# EasyEDA Pro project Project.epro

# Schematic stm32f1

## Sheets
1 stm32f1
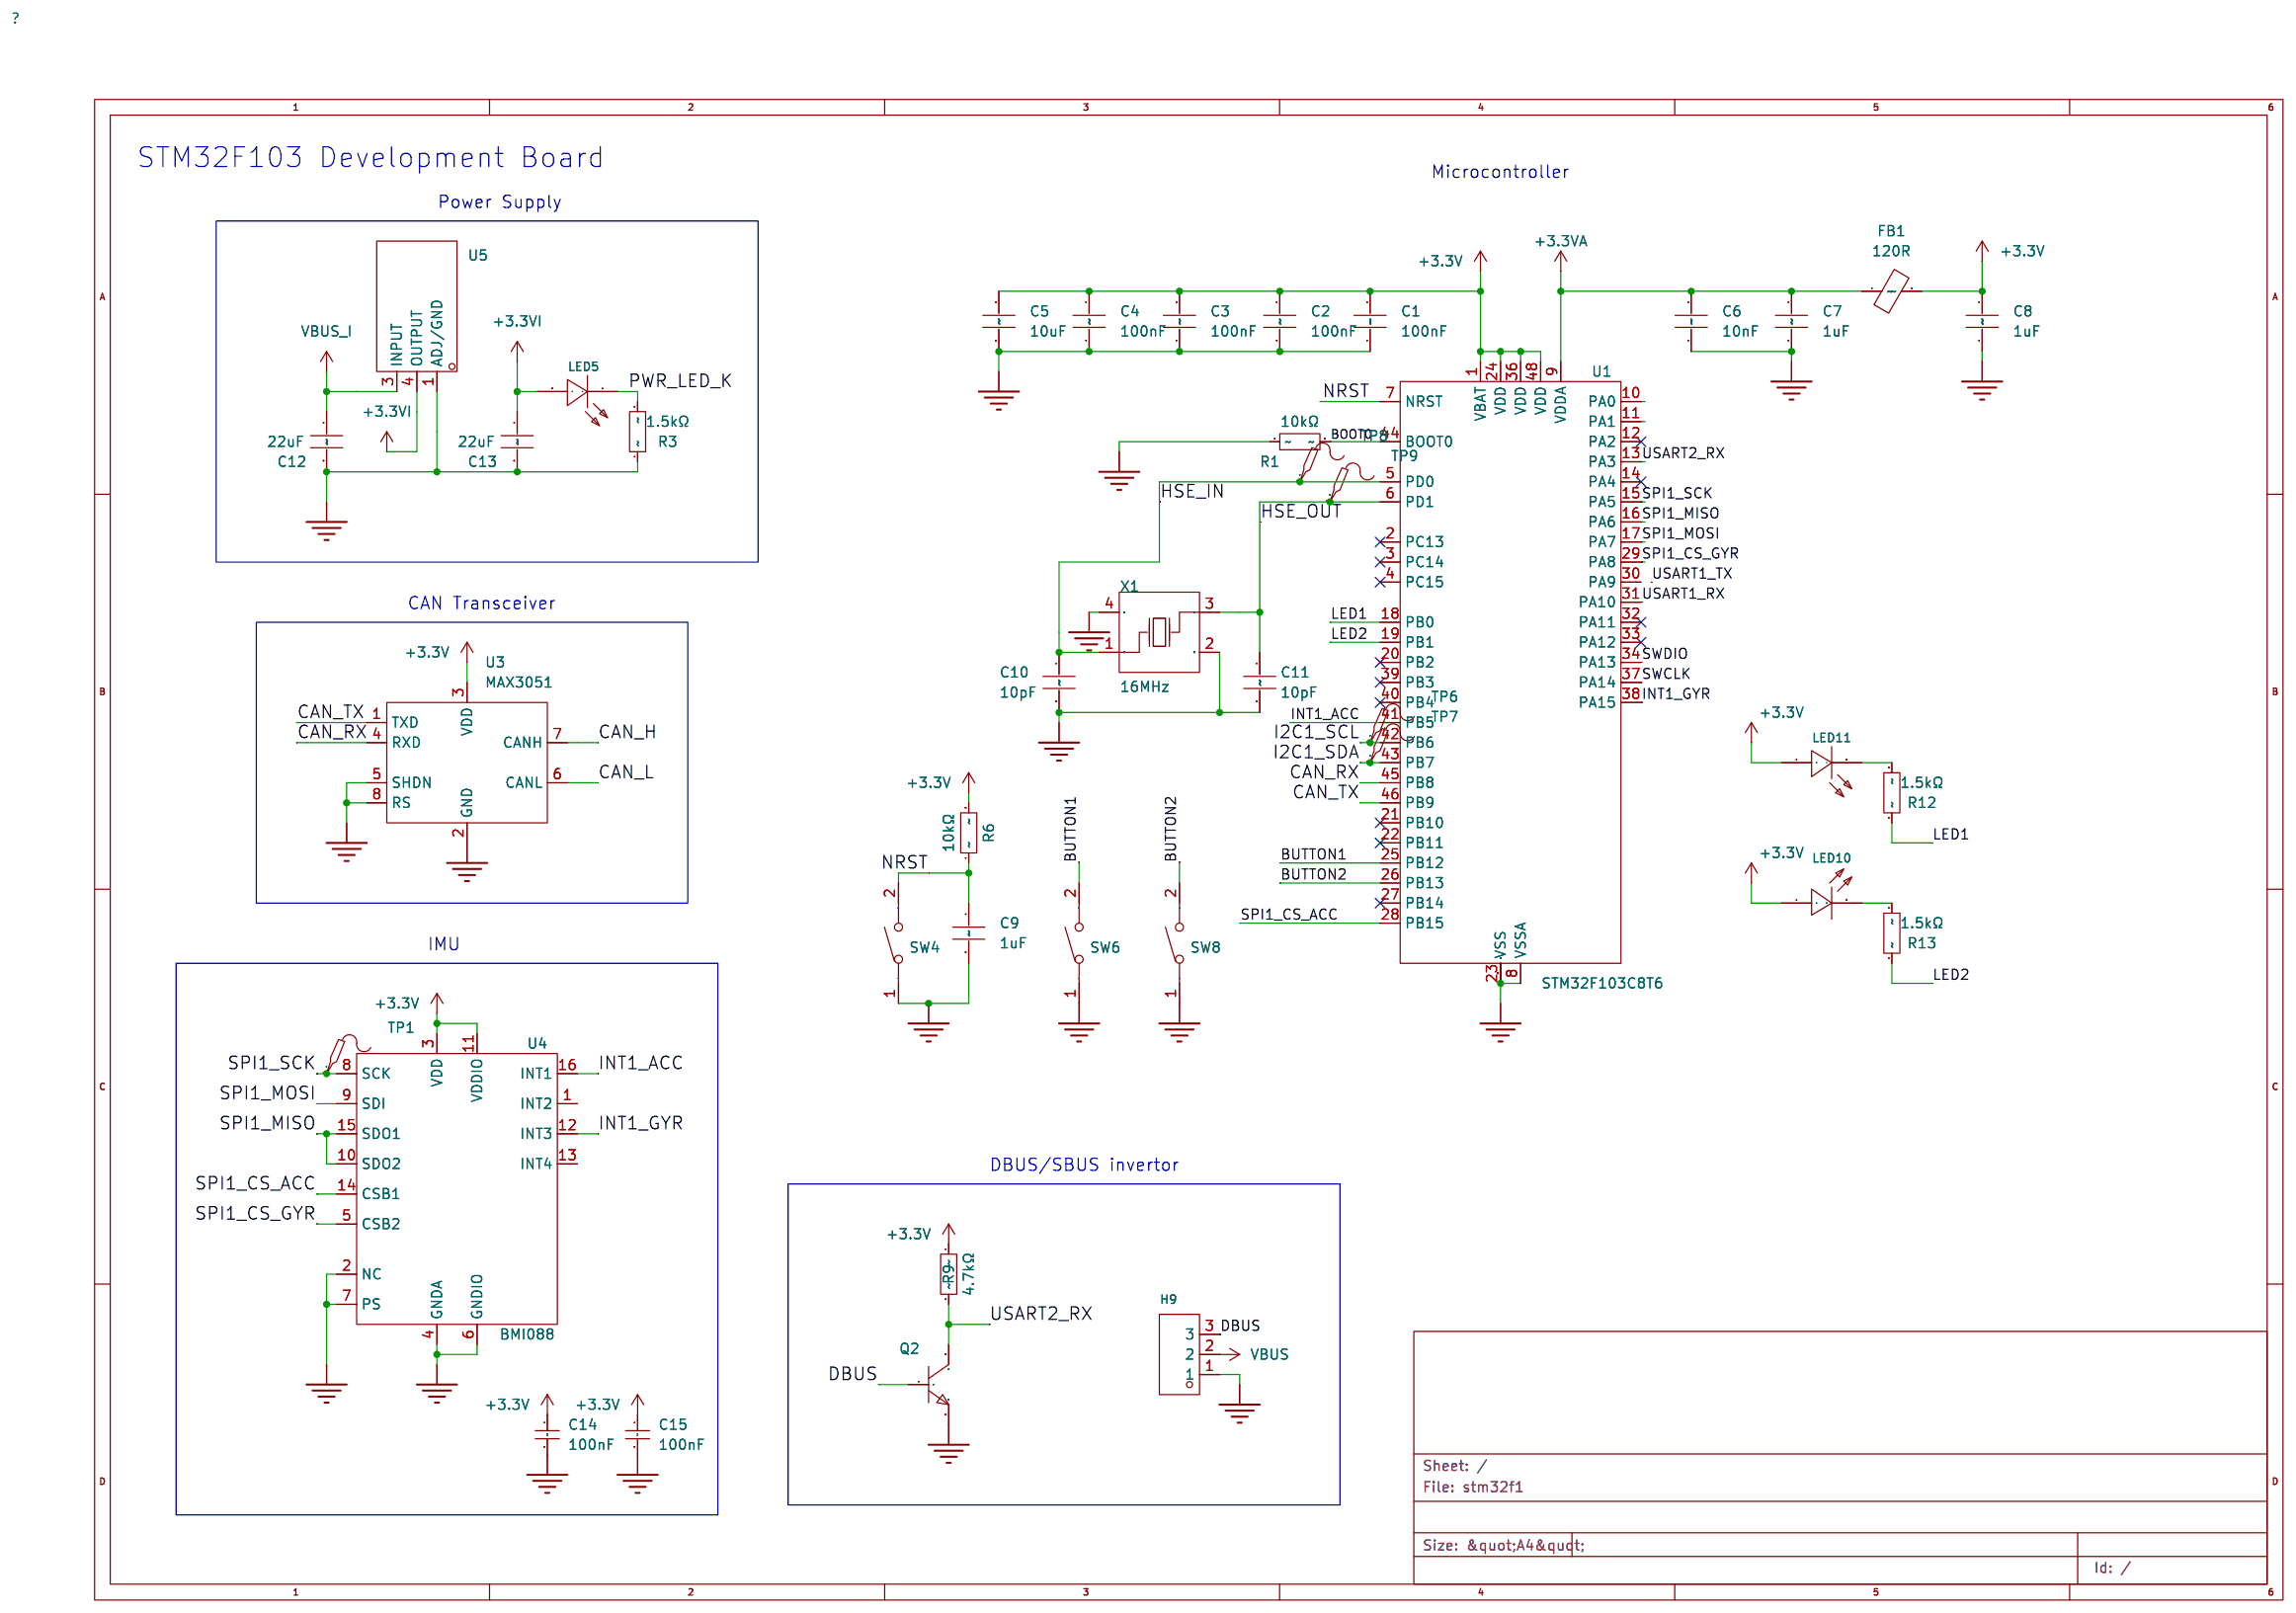
[diagram p0: stm32f1]
2 connectors: Create Date: 2023-10-02; Page Name: connectors; Project Name: stm32f1; Schematic Name: stm32f1; Update Date: 2023-10-05; Company: 嘉立创EDA; Page Size: A4; Version: V1.0
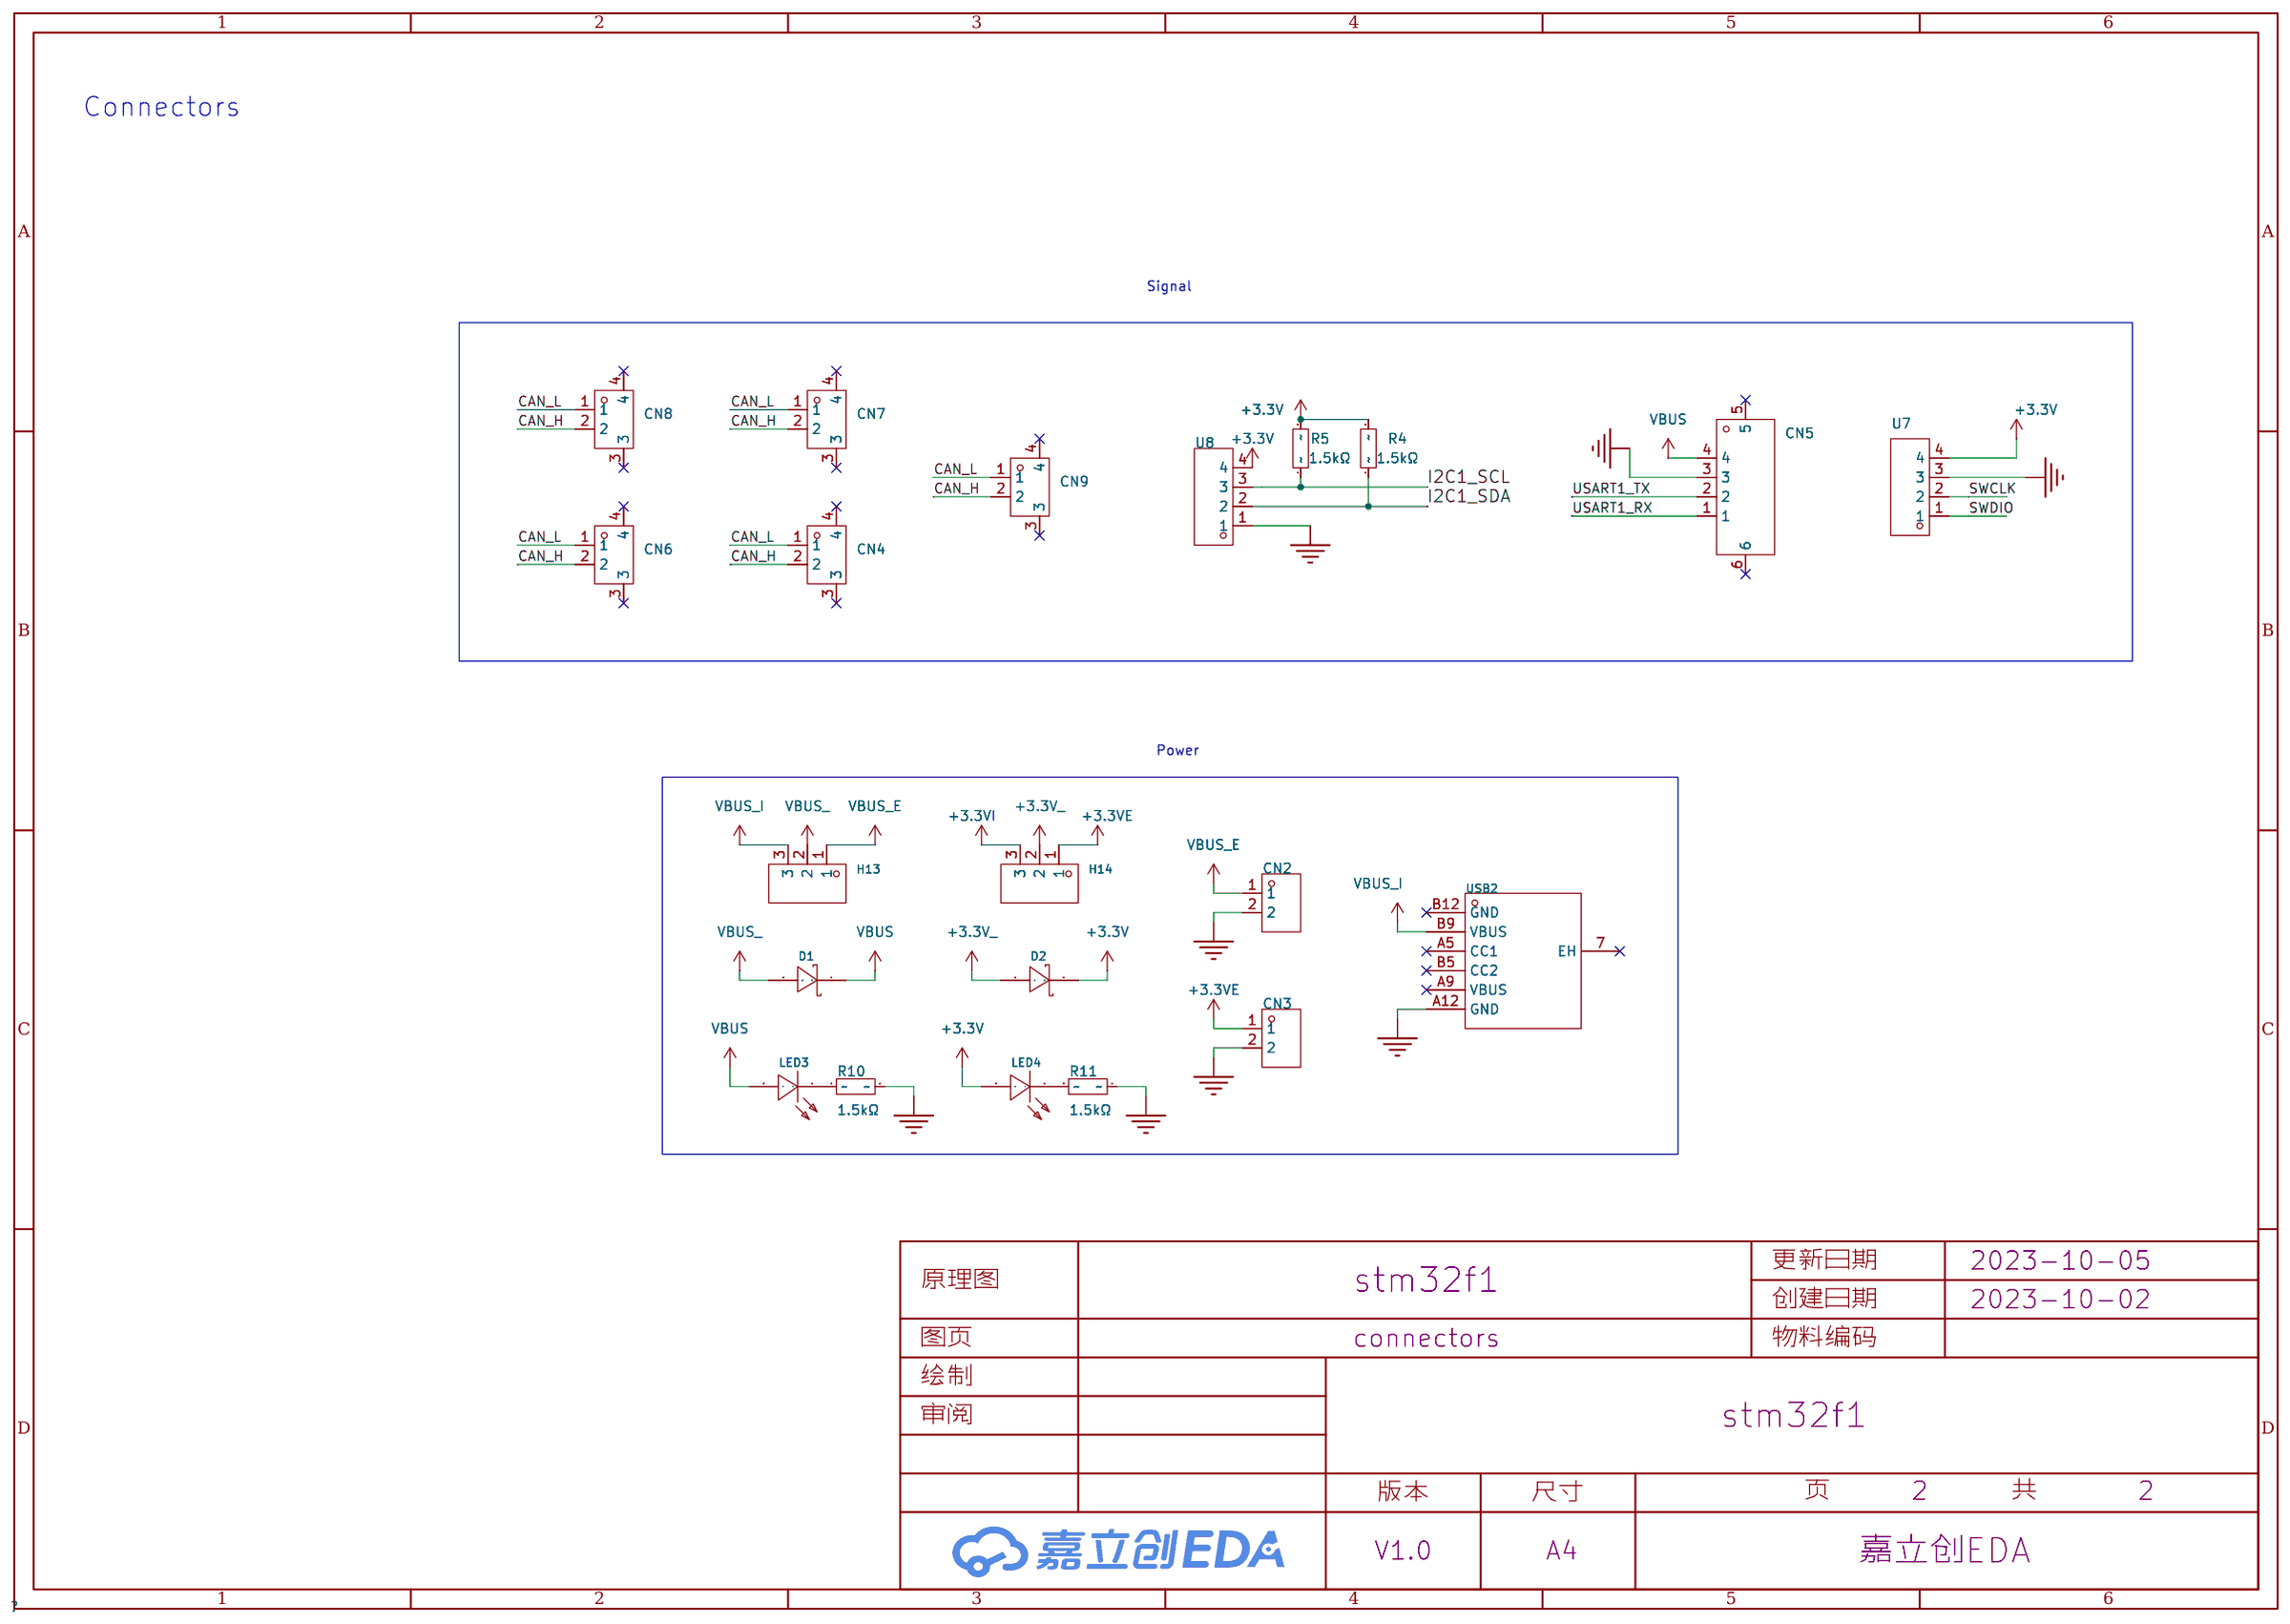
[diagram p1: connectors]

## Parts
sheet connectors
CN2  XT30U-M  [CONN-TH_XT30U-M]
CN3  XT30U-M  [CONN-TH_XT30U-M]
CN4  L125WVS-02PW  [CONN-SMD_2P-P1.25_DELON_L125WVS-02PW]
CN5  GH125-S04DCA-00  [CONN-SMD_4P-P1.27_GH125-S04DCA-00]
CN6  L125WVS-02PW  [CONN-SMD_2P-P1.25_DELON_L125WVS-02PW]
CN7  L125WVS-02PW  [CONN-SMD_2P-P1.25_DELON_L125WVS-02PW]
CN8  L125WVS-02PW  [CONN-SMD_2P-P1.25_DELON_L125WVS-02PW]
CN9  L125WVS-02PW  [CONN-SMD_2P-P1.25_DELON_L125WVS-02PW]
D1  1N5819WS  [SOD-323_L1.8-W1.3-LS2.5-RD]
D2  1N5819WS  [SOD-323_L1.8-W1.3-LS2.5-RD]
H13  PZ254R-11-03P  [HDR-TH_3P-P2.54-H-M-W10.4]
H14  PZ254R-11-03P  [HDR-TH_3P-P2.54-H-M-W10.4]
LED3  NCD0805R1  [LED0805-RD_RED]
LED4  NCD0805R1  [LED0805-RD_RED]
R4  1.5kΩ  [R0805]
R5  1.5kΩ  [R0805]
R10  1.5kΩ  [R0805]
R11  1.5kΩ  [R0805]
U7  HDGC1251WR-4P  [CONN-TH_4P-P1.25_HDGC_HDGC1251WR-4P]
U8  HDGC1251WR-4P  [CONN-TH_4P-P1.25_HDGC_HDGC1251WR-4P]
USB2  TYPE-C 6P(073)  [TYPE-C-SMD_TYPE-C-6P]
sheet stm32f1
C1  100nF  [C0805]
C2  100nF  [C0805]
C3  100nF  [C0805]
C4  100nF  [C0805]
C5  10uF  [C0805]
C6  10nF  [C0805]
C7  1uF  [C0805]
C8  1uF  [C0805]
C9  1uF  [C0805]
C10  10pF  [C0805]
C11  10pF  [C0805]
C12  22uF  [C0805]
C13  22uF  [C0805]
C14  100nF  [C0805]
C15  100nF  [C0805]
FB1  120R  [L0805]
H9  PZ254R-11-03P  [HDR-TH_3P-P2.54-H-M-W10.4]
LED5  NCD0805R1  [LED0805-RD_RED]
LED10  NCD0805G1  [LED0805-R-RD]
LED11  NCD0805B2  [LED0805-R-RD]
Q2  PMBT3904,215  [SOT-23_L2.9-W1.3-P1.90-LS2.4-BR]
R1  10kΩ  [R0805]
R3  1.5kΩ  [R0805]
R6  10kΩ  [R0805]
R9  4.7kΩ  [R0805]
R12  1.5kΩ  [R0805]
R13  1.5kΩ  [R0805]
SW4  TS-1088-AR02016  [SW-SMD_L3.9-W3.0-P4.45]
SW6  TS-1088-AR02016  [SW-SMD_L3.9-W3.0-P4.45]
SW8  TS-1088-AR02016  [SW-SMD_L3.9-W3.0-P4.45]
TP1  -  [Test-Point-0.5mm]
TP6  -  [Test-Point-0.5mm]
TP7  -  [Test-Point-0.5mm]
TP8  -  [Test-Point-0.5mm]
TP9  -  [Test-Point-0.5mm]
U1  STM32F103C8T6  [LQFP-48_L7.0-W7.0-P0.50-LS9.0-BL]
U3  MAX3051  [SOIC-8_L4.9-W3.9-P1.27-LS6.2-BL]
U4  BMI088  [LGA-16_L4.5-W3.0-P0.50-BL]
U5  AZ1117D-3.3TRE1  [TO-252-2_L6.5-W6.1-P4.58-LS10.0-BR]
X1  16MHz  [OSC-SMD_4P-L3.2-W2.5-BL]

## Library data of the parts
CN2 CN3 = XT30U-M: 模型插头轻量版锂电池插头; LCSC Part Name: AMASS(艾迈斯)轻量版锂电池插头公头 XT30U-M; Supplier Part: C99101; Manufacturer: AMASS(艾迈斯); JLCPCB Part Class: Extended Part; Datasheet: https://atta.szlcsc.com/upload/public/pdf/source/20170606/1496716542582.pdf; Supplier: LCSC
CN4 CN6-CN9 = L125WVS-02PW: 间距:1.25mm;插针结构:1x2P;排数:1;每排PIN数:2;公母:公型插针;安装方式:卧贴;额定电流:1A;工作温度范围:-40℃~+110℃;; LCSC Part Name: 1.25mm 1x2P 卧贴 GH1.25间距卧式贴片 2P 连接器; Supplier Part: C2998790; Manufacturer: DEALON(德艺隆); Supplier Footprint: SMD,P=1.25mm; JLCPCB Part Class: Extended Part; Datasheet: https://atta.szlcsc.com/upload/public/pdf/source/20220425/50B09E6409C3A2782C6D65104D18E34A.pdf; Supplier: LCSC; Pitch: 1.25mm; Pins Structure: 1x2P; Number of Rows: 1; Number of PINs Per Row: 2; Gender: 公型插针; Mounting Style: 卧贴; Current Rating (Max): 1A; Operating Temperature Range: -40℃~+110℃
CN5 = GH125-S04DCA-00: 参考系列:-;间距:1.25mm;插针结构:1x4P;排数:1;每排PIN数:4;行距:-;公母:公型插针;安装方式:卧贴;额定电流:1A;工作温度范围:-25℃~+85℃;; LCSC Part Name: GH1.25卧式贴片 带扣; Supplier Part: C2886767; Manufacturer: JS(钜硕电子); Supplier Footprint: SMD,P=1.25mm; JLCPCB Part Class: 扩展库; Datasheet: https://atta.szlcsc.com/upload/public/pdf/source/20210818/CD11791E5ED3EDF45A7009E9C8A2BD4C.pdf; Supplier: LCSC; Pitch: 1.25mm; Pins Structure: 1x4P; Number of Rows: 1; Number of PINs Per Row: 4; Gender: 公型插针; Mounting Style: 卧贴; Current Rating (Max): 1A; Operating Temperature Range: -25℃~+85℃
D1 D2 = 1N5819WS_C191023: 直流反向耐压(Vr):40V;平均整流电流(Io):1A;正向压降(Vf):600mV@1A;; LCSC Part Name: 40V 1A 600mV@1A; Supplier Part: C191023; Manufacturer: Hottech(合科泰); Supplier Footprint: SOD-323; JLCPCB Part Class: Basic Part; Datasheet: https://atta.szlcsc.com/upload/public/pdf/source/20220428/3CB86FD8D28D653594B4E35F9D5AEFD9.pdf; Supplier: LCSC; Reverse Voltage (Vr): 40V; Average Rectified Current (Io): 1A; Forward Voltage (Vf@If): 600mV@1A
H9 H13 H14 = PZ254R-11-03P: 排数:单排;总PIN位数:3P;间距:2.54mm;插针结构:1x3P;行距:-;安装类型:弯插;圆针/方针:方针;额定电流:-;额定电压:-;配合针长度:6mm;塑高:2.5mm;触头材质:黄铜;触头镀层:-;工作温度范围:-40℃~+105℃;颜色:黑色;; LCSC Part Name: 2.54mm 1x3P 弯插 方针; Supplier Part: C492411; Manufacturer: XFCN(兴飞); Supplier Footprint: 弯插,P=2.54mm; JLCPCB Part Class: Extended Part; Datasheet: https://atta.szlcsc.com/upload/public/pdf/source/20200309/C492411_5256E8AAA7569F6D33B6ADBFAE4F2888.pdf; Supplier: LCSC; Number of Rows: 单排; Number of Pins: 3P; Pitch: 2.54mm; Pin Structure: 1x3P; Mounting Type: 弯插; Circluar Pins/Square Pins: 方针; Length of Mating Pin: 6mm; Insulation Height: 2.5mm; Contact Material: 黄铜; Operating Temperature Range: -40℃~+105℃; Color: 黑色
LED3-LED5 = NCD0805R1: 发光颜色:红灯;; LCSC Part Name: 红灯; Supplier Part: C84256; Manufacturer: 国星光电; Supplier Footprint: 0805; JLCPCB Part Class: Basic Part; Datasheet: https://atta.szlcsc.com/upload/public/pdf/source/20200820/C84256_F0A75A43B3EAD75808600A0514C76B99.pdf; Supplier: LCSC; Emitted Color: 红灯
R3-R5 R10-R13 = 0805W8F1501T5E: 电阻类型:厚膜电阻;阻值:1.5kΩ;精度:±1%;功率:125mW;; LCSC Part Name: 1.5kΩ ±1% 125mW; Supplier Part: C4310; Manufacturer: UNI-ROYAL(厚声); Supplier Footprint: 0805; JLCPCB Part Class: Basic Part; Datasheet: https://atta.szlcsc.com/upload/public/pdf/source/20200306/C422600_1E6D84923E4A46A82E41ADD87F860B5C.pdf; Supplier: LCSC; Type: 厚膜电阻; Tolerance: ±1%; Power(Watts): 125mW; Temperature Coefficient: ±100ppm/℃; Overload Voltage (Max): 150V; Operating Temperature Range: -55℃~+155℃
U7 U8 = HDGC1251WR-4P: LCSC Part Name: MX1.25弯针 4P; Supplier Part: C5175205; Manufacturer: HDGC(华德共创); Supplier Footprint: 直插,P=1.25mm; JLCPCB Part Class: 扩展库; Datasheet: https://atta.szlcsc.com/upload/public/pdf/source/20220916/6B39EFECC0008CEF03BA0E93409F6DCC.pdf; Supplier: LCSC
USB2 = TYPE-C 6P(073): 连接器类型:Type-C;标准:-;公母:母座;触点数量:6P;端口数量:1;安装方式:卧贴;额定电流 - 电源:5A;工作温度范围:-25℃~+85℃;; LCSC Part Name: Type-C 母座 卧贴; Supplier Part: C668623; Manufacturer: SHOU HAN(首韩); Supplier Footprint: SMD; JLCPCB Part Class: Extended Part; Datasheet: https://atta.szlcsc.com/upload/public/pdf/source/20200618/C668623_A4B260DED7AC1949BAC6AE39E9F4CD80.pdf; Supplier: LCSC; Connector Type: Type-C; Gender: 母座; Number of Contacts: 6P; Number of Ports: 1; Mounting Style: 卧贴; Current Rating - Power (Max): 5A; Operating Temperature Range: -25℃~+85℃
C1-C4 = 0805B104K500NT: 容值:100nF;精度:±10%;额定电压:50V;材质(温度系数):X7R;; LCSC Part Name: 100nF ±10% 50V; Supplier Part: C38141; Manufacturer: FH(风华); Supplier Footprint: 0805; JLCPCB Part Class: Extended Part; Datasheet: https://atta.szlcsc.com/upload/public/pdf/source/20170923/C38141_1506149447419988747.pdf; Supplier: LCSC; Tolerance: ±10%; Voltage Rated: 50V; Temperature Coefficient: X7R
C5 = CL21A106KAYNNNE_C15850: 容值:10uF;精度:±10%;额定电压:25V;材质(温度系数):X5R;; LCSC Part Name: 10uF ±10% 25V; Supplier Part: C15850; Manufacturer: SAMSUNG(三星); Manufacturer Part: CL21A106KAYNNNE; Supplier Footprint: 0805; JLCPCB Part Class: Basic Part; Datasheet: https://atta.szlcsc.com/upload/public/pdf/source/20160103/1457707679302.pdf; Supplier: LCSC; Tolerance: ±10%; Voltage Rated: 25V; Temperature Coefficient: X5R
C6 = CC0603KRX7R9BB103: 容值:10nF;精度:±10%;额定电压:50V;材质(温度系数):X7R;; LCSC Part Name: 10nF ±10% 50V; Supplier Part: C100042; Manufacturer: YAGEO(国巨); Supplier Footprint: 0603; JLCPCB Part Class: Extended Part; Datasheet: https://atta.szlcsc.com/upload/public/pdf/source/20180326/C100042_E8B0111D51DE3671A0A4A59FBCEFE81C.pdf; Supplier: LCSC; Tolerance: ±10%; Voltage Rated: 50V; Temperature Coefficient: X7R
C7-C9 = CL21B105KBFNNNE: 容值:1uF;精度:±10%;额定电压:50V;材质(温度系数):X7R;; LCSC Part Name: 1uF ±10% 50V; Supplier Part: C28323; Manufacturer: SAMSUNG(三星); Supplier Footprint: 0805; JLCPCB Part Class: Basic Part; Datasheet: https://atta.szlcsc.com/upload/public/pdf/source/20160103/1457707718219.pdf; Supplier: LCSC; Tolerance: ±10%; Voltage Rated: 50V; Temperature Coefficient: X7R
C10 C11 = 0805CG100J500NT: 容值:10pF;精度:±5%;额定电压:50V;材质(温度系数):C0G;; LCSC Part Name: 10pF ±5% 50V; Supplier Part: C157608; Manufacturer: FH(风华); Supplier Footprint: 0805; JLCPCB Part Class: Extended Part; Datasheet: https://atta.szlcsc.com/upload/public/pdf/source/20171221/C157608_15138397142581196117.pdf; Supplier: LCSC; Tolerance: ±5%; Voltage Rated: 50V; Temperature Coefficient: C0G
C12 C13 = CL10A226MQ8NRNC: 容值:22uF;精度:±20%;额定电压:6.3V;材质(温度系数):X5R;; LCSC Part Name: 22uF ±20% 6.3V; Supplier Part: C59461; Manufacturer: SAMSUNG(三星); Supplier Footprint: 0603; JLCPCB Part Class: Basic Part; Datasheet: https://atta.szlcsc.com/upload/public/pdf/source/20160103/1457707740762.pdf; Supplier: LCSC; Tolerance: ±20%; Voltage Rated: 6.3V; Temperature Coefficient: X5R
C14 C15 = 0805B104K500NT: 容值:100nF;精度:±10%;额定电压:50V;材质(温度系数):X7R;; LCSC Part Name: 100nF ±10% 50V; Supplier Part: C38141; Manufacturer: FH(风华); Supplier Footprint: 0805; JLCPCB Part Class: Extended Part; Datasheet: https://atta.szlcsc.com/upload/public/pdf/source/20170923/C38141_1506149447419988747.pdf; Supplier: LCSC; Tolerance: ±10%; Voltage Rated: 50V; Temperature Coefficient: X7R; LCSC Part #: C1525
FB1 = BLM21PG221SN1D: 标称阻抗@测试频率:220Ω@100MHz;误差:±25%;直流电阻(RDC):45mΩ;; LCSC Part Name: 单路 0805磁珠 阻抗220Ω@100MHz; Supplier Part: C85840; Manufacturer: muRata(村田); Supplier Footprint: 0805; JLCPCB Part Class: Extended Part; Datasheet: https://atta.szlcsc.com/upload/public/pdf/source/20180326/C85840_F6A7C3BA14DD00AC8BE744C9601BB345.pdf; Supplier: LCSC; Impedance @ Frequency: 220Ω@100MHz; Tolerance: ±25%; DC Resistance: 45mΩ; Current Rating: 2A; Circuits: 1
LED10 = NCD0805G1: 发光颜色:翠绿;; LCSC Part Name: 翠绿 0805翠绿  正贴; Supplier Part: C84260; Manufacturer: 国星光电; Supplier Footprint: 0805; JLCPCB Part Class: Extended Part; Datasheet: https://atta.szlcsc.com/upload/public/pdf/source/20200820/C84260_AFC7BF57C6FBA034D182BB8D10A67EFE.pdf; Supplier: LCSC; Emitted Color: 翠绿
LED11 = NCD0805B2: 发光颜色:蓝灯;; LCSC Part Name: 蓝灯 0805蓝灯   正贴; Supplier Part: C84259; Manufacturer: 国星光电; Supplier Footprint: 0805; JLCPCB Part Class: Extended Part; Datasheet: https://atta.szlcsc.com/upload/public/pdf/source/20200820/C84259_E5AC6865415989C4C2C2831134BA3A23.pdf; Supplier: LCSC; Emitted Color: 蓝灯
Q2 = PMBT3904,215: 晶体管类型:NPN;集射极击穿电压(Vceo):40V;集电极电流(Ic):200mA;功率(Pd):250mW;直流电流增益(hFE@Ic,Vce):100@10mA,1V;; LCSC Part Name: NPN 40V 200mA; Supplier Part: C8667; Manufacturer: Nexperia(安世); Supplier Footprint: SOT-23; JLCPCB Part Class: 扩展库; Datasheet: https://atta.szlcsc.com/upload/public/pdf/source/20210520/C8667_82CC4B18F957EC74ED6E8B4E120941E6.pdf; Supplier: LCSC; Transistor Type: NPN; Collector-Emitter Breakdown Voltage (Vceo): 40V; Collector Current (Ic): 200mA; Power Dissipation (Pd): 250mW; Collector Cut-Off Current (Icbo): 50nA; Collector-Emitter Saturation Voltage (VCE(sat)@Ic,Ib): 300mV@50mA,5mA; DC Current Gain (hFE@Ic,Vce): 100@10mA,1V; Transition Frequency (fT): 300MHz; Operating Temperature: +150℃@(Tj)
R1 R6 = 0805W8F1002T5E_C17414: 电阻类型:厚膜电阻;阻值:10kΩ;精度:±1%;功率:125mW;; LCSC Part Name: 10kΩ ±1% 125mW; Supplier Part: C17414; Manufacturer: UNI-ROYAL(厚声); Manufacturer Part: 0805W8F1002T5E; Supplier Footprint: 0805; JLCPCB Part Class: Basic Part; Datasheet: https://atta.szlcsc.com/upload/public/pdf/source/20200306/C422600_1E6D84923E4A46A82E41ADD87F860B5C.pdf; Supplier: LCSC; Type: 厚膜电阻; Tolerance: ±1%; Power(Watts): 125mW; Temperature Coefficient: ±100ppm/℃; Overload Voltage (Max): 150V; Operating Temperature Range: -55℃~+155℃
R9 = 0805W8F4701T5E: 电阻类型:厚膜电阻;阻值:4.7kΩ;精度:±1%;功率:125mW;; LCSC Part Name: 4.7kΩ ±1% 125mW; Supplier Part: C17673; Manufacturer: UNI-ROYAL(厚声); Supplier Footprint: 0805; JLCPCB Part Class: Basic Part; Datasheet: https://atta.szlcsc.com/upload/public/pdf/source/20200306/C422600_1E6D84923E4A46A82E41ADD87F860B5C.pdf; Supplier: LCSC; Type: 厚膜电阻; Tolerance: ±1%; Power(Watts): 125mW; Temperature Coefficient: ±100ppm/℃; Overload Voltage (Max): 150V; Operating Temperature Range: -55℃~+155℃
SW4 SW6 SW8 = TS-1088-AR02016: 触点电流:50mA;额定电压(DC):12V;绝缘电阻:100MΩ;电路结构:单刀单掷;安装方式:立贴;作用力:160gf@±50gf;机械寿命:10万次;带支架:否;; LCSC Part Name: 4*3*2mm 立贴 轻触开关; Supplier Part: C720477; Manufacturer: XUNPU(讯普); Supplier Footprint: SMD; JLCPCB Part Class: Extended Part; Datasheet: https://atta.szlcsc.com/upload/public/pdf/source/20200810/C720475_60D09DD6C54279ADDB2DC25100F1CC11.pdf; Supplier: LCSC; Contact Current: 50mA; Voltage Rating (DC): 12V; Insulation Resistance: 100MΩ; Circuit: 单刀单掷; Mounting Style: 立贴; Actuator Style: 圆形按钮; Actuator/Cap Color: 黑色; Operating Force: 160gf@±50gf; Mechanical Life: 10万次; Operating Temperature: -30℃~+80℃; Pin Style: SMD接片; Switch Length: 4mm; Switch Width: 3mm; Switch Height: 2mm; Strike Gundam: 否
TP1 TP6-TP9 = Test-Point: Test Point 测试点
U1 = MCU_ST_STM32F1_STM32F103C8Tx: User doc link: https://www.st.com/resource/en/datasheet/stm32f103c8.pdf
U3 = MAX3051ESA: 收发器 数据速率：1Mbps 电源供电压(Vcc)：3.3V; LCSC Part Name: CAN芯片; Supplier Part: C5342102; Manufacturer: Tokmas(托克马斯); Supplier Footprint: SOP-8; JLCPCB Part Class: Extended Part; Datasheet: https://atta.szlcsc.com/upload/public/pdf/source/20221230/D64245D6103484F919C36DCA59EFC6C3.pdf; Supplier: LCSC; User doc link: http://datasheets.maximintegrated.com/en/ds/MAX3051.pdf
U4 = BMI088: Supplier Part: C194919; Manufacturer: Bosch(博世); Supplier Footprint: LGA-16; JLCPCB Part Class: Extended Part; Datasheet: https://atta.szlcsc.com/upload/public/pdf/source/20180628/C194919_66CCF125FF968C218A4D358C68AC68D6.pdf; Supplier: LCSC; LCSC Part #: C194919
U5 = AZ1117D-3.3TRE1: 输出类型:固定;输出极性:正;最大输入电压:15V;输出电压:3.3V;输出电流:1A;电源纹波抑制比(PSRR):72dB@(120Hz);; Supplier Part: C362112; Manufacturer: DIODES(美台); Supplier Footprint: TO-252; JLCPCB Part Class: Extended Part; Datasheet: https://atta.szlcsc.com/upload/public/pdf/source/20181205/C110475_93E0B5F7267F457583F8503C8159CAD9.pdf; Supplier: LCSC; Output Type: 固定; Output Polarity: 正; Number of Outputs: 1; Maximum Input Voltage: 15V; Output Voltage: 3.3V; Dropout Voltage: 1.5V@(1A); Output Current: 1A; Power Supply Rejection Ratio (PSRR): 72dB@(120Hz)
X1 = X322516MLB4SI: 频率:16MHz;频率公差:±10ppm;负载电容:9pF;; LCSC Part Name: 16MHz ±10ppm 9pF YSX321SL; Supplier Part: C13738; Manufacturer: YXC(扬兴晶振); Supplier Footprint: SMD3225-4P; JLCPCB Part Class: Basic Part; Datasheet: https://atta.szlcsc.com/upload/public/pdf/source/20210329/C112971_1F611BDC486E193C1706F6D8EB5AA189.pdf; Supplier: LCSC; Crystal Type: 贴片无源晶振; Frequency Tolerance: ±10ppm; Frequency Stability: ±30ppm; Load Capacitance: 9pF; Operating Temperature: -40℃~+85℃

## Nets
+3.3V: C1.1 C2.1 C3.1 C4.1 C5.1 C8.1 C14.1 C15.1 D2.1(K) FB1.2 LED4.2(+) LED10.1(A) LED11.1(+) R4.2 R5.2 R6.2 R9.1 U1.1(VBAT) U1.24(VDD) U1.36(VDD) U1.48(VDD) U3.3(VDD) U4.3(VDD) U4.11(VDDIO) U7.4 U8.4
+3.3V_: D2.2(A) H14.2
+3.3VA: C6.1 C7.1 FB1.1 U1.9(VDDA)
+3.3VE: CN3.1 H14.1
+3.3VI: C13.1 H14.3 LED5.2(+) U5.4(OUTPUT)
GND: C1.2 C2.2 C3.2 C4.2 C5.2 C6.2 C7.2 C8.2 C9.2 C10.2 C11.2 C12.2 C13.2 C14.2 C15.2 CN2.2 CN3.2 CN5.3 H9.1 Q2.2 R1.1 R3.1 R10.1 R11.1 SW4.1 SW6.1 SW8.1 U1.8(VSSA) U1.23(VSS) U1.35(VSS) U1.47(VSS) U3.2(GND) U3.5(SHDN) U3.8(RS) U4.2(NC) U4.4(GNDA) U4.6(GNDIO) U4.7(PS) U5.1(ADJ/GND) U7.3 U8.1 USB2.A12(GND) X1.2(GND) X1.4(GND)
VBUS: CN5.4 D1.1(K) H9.2 LED3.2(+)
VBUS_: D1.2(A) H13.2
VBUS_E: CN2.1 H13.1
VBUS_I: C12.1 H13.3 U5.3(INPUT) USB2.B9(VBUS)
BOOT0: R1.2 U1.44(BOOT0)
BUTTON1: SW6.2 U1.25(PB12)
BUTTON2: SW8.2 U1.26(PB13)
CAN_H: CN4.2 CN6.2 CN7.2 CN8.2 CN9.2 U3.7(CANH)
CAN_L: CN4.1 CN6.1 CN7.1 CN8.1 CN9.1 U3.6(CANL)
CAN_RX: U1.45(PB8) U3.4(RXD)
CAN_TX: U1.46(PB9) U3.1(TXD)
DBUS: H9.3 Q2.1
HSE_IN: C10.1 TP8.1 U1.5(PD0) X1.1(OSC1)
HSE_OUT: C11.1 TP9.1 U1.6(PD1) X1.3(OSC2)
I2C1_SCL: R5.1 TP6.1 U1.42(PB6) U8.3
I2C1_SDA: R4.1 TP7.1 U1.43(PB7) U8.2
INT1_ACC: U1.41(PB5) U4.16(INT1)
INT1_GYR: U1.38(PA15) U4.12(INT3)
LED1: R12.1 U1.18(PB0)
LED2: R13.1 U1.19(PB1)
NRST: C9.1 R6.1 SW4.2 U1.7(NRST)
PWR_LED_K: LED5.1(-) R3.2
SPI1_CS_ACC: U1.28(PB15) U4.14(CSB1)
SPI1_CS_GYR: U1.29(PA8) U4.5(CSB2)
SPI1_MISO: U1.16(PA6) U4.10(SDO2) U4.15(SDO1)
SPI1_MOSI: U1.17(PA7) U4.9(SDI)
SPI1_SCK: TP1.1 U1.15(PA5) U4.8(SCK)
SWCLK: U1.37(PA14) U7.2
SWDIO: U1.34(PA13) U7.1
USART1_RX: CN5.1 U1.31(PA10)
USART1_TX: CN5.2 U1.30(PA9)
USART2_RX: Q2.3 R9.2 U1.13(PA3)
$1N15895: LED11.2(-) R12.2
$1N15981: LED10.2(K) R13.2
$7N3476: LED3.1(-) R10.2
$7N3478: LED4.1(-) R11.2

Not connected (* = marked no-connect by the designer): CN4 3* 4*; CN5 5* 6*; CN6 3* 4*; CN7 3* 4*; CN8 3* 4*; CN9 3* 4*; U1 2(PC13)* 3(PC14)* 4(PC15)* 10(PA0) 11(PA1) 12(PA2)* 14(PA4)* 20(PB2)* 21(PB10)* 22(PB11)* 27(PB14)* 32(PA11)* 33(PA12)* 39(PB3)* 40(PB4)*; U4 1(INT2) 13(INT4); USB2 7(EH)* A5(CC1)* A9(VBUS)* B5(CC2)* B12(GND)*

## Notes on the sheets
sheet 1
- STM32F103 Development Board
- Microcontroller
- Power Supply
- CAN Transceiver
- IMU
- DBUS/SBUS invertor
sheet 2
- Connectors
- Signal
- Power

# Board stm32f1
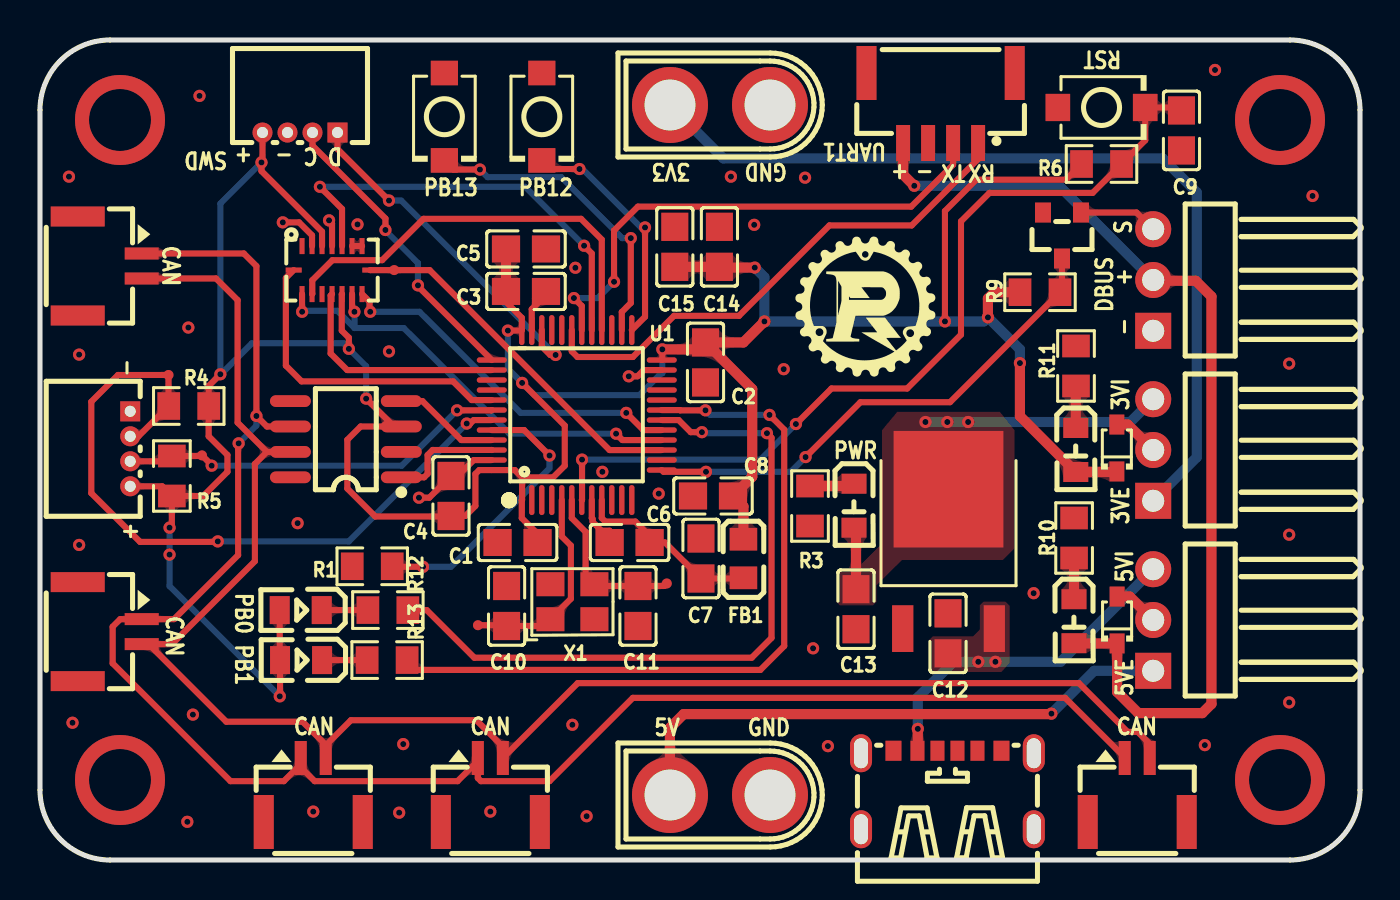
[diagram p2: board, top side]
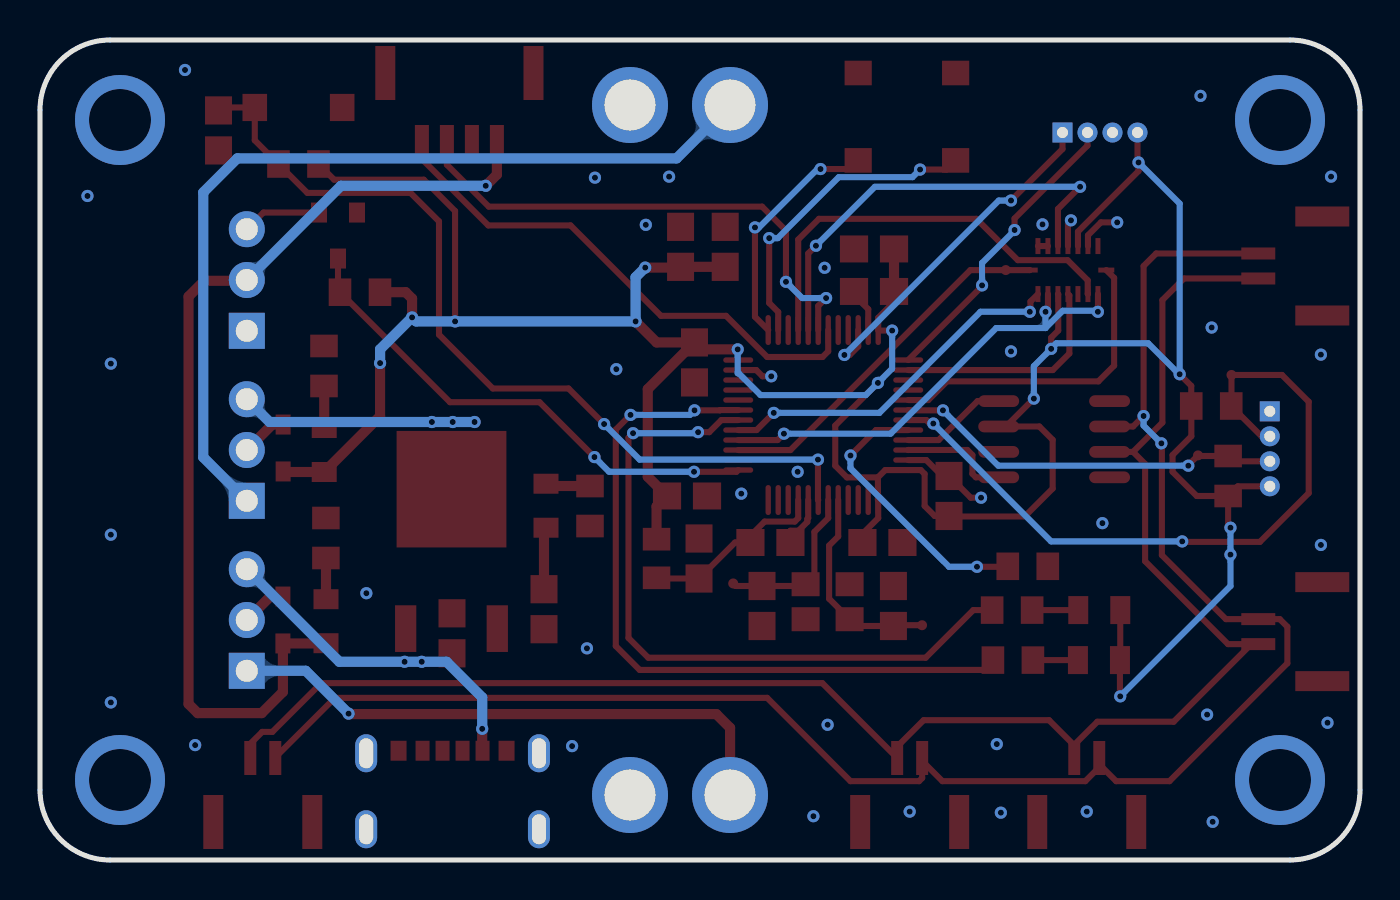
[diagram p3: board, bottom side, seen from below]

Outline 66 x 41 mm; copper layers: Top Layer, Bottom Layer. Coordinates in mm from the lower left corner of the outline.
Outline path: 0,37.5 0,3.5 arc(1.03,1.03) 3.5,0 62.5,0 arc(64.97,1.03) 66,3.5 66,37.5 arc(64.97,39.97) 62.5,41 3.5,41 arc(1.03,39.97) 0,37.5
Stack: Top Layer 0.035mm / Dielectric1 1.51mm FR4 er 4.5 / Bottom Layer 0.035mm

## Design rules (mm)
template: 用户自定义配置
spacing safeClearance (default): track to track 0.152, other pairs 0.152 to 0.3
track width trackWidth (default): min 0.127, default 0.254, max 2.54
differential pair differentialPair (default): width min 0.127, default 0.254, max 2.54; gap min 0.152, default 0.152
via viaSize (default): diameter min 0.5, default 0.61, max 10; hole min 0.3, default 0.305, max 5.999
net GND uses copperRegion1

## Placement (name value [footprint] x y rotation side)
C1  100nF  [C0805]  23.88 15.88 180 top
C2  100nF  [C0805]  33.28 24.88 270 top
C3  100nF  [C0805]  24.3 28.43 0 top
C4  100nF  [C0805]  20.55 18.2 90 top
C5  10uF  [C0805]  24.3 30.55 0 top
C6  10nF  [C0805]  29.48 15.88 180 top
C7  1uF  [C0805]  33.05 15.07 90 top
C8  1uF  [C0805]  33.65 18.2 180 top
C9  1uF  [C0805]  57.07 36.48 270 top
C10  10pF  [C0805]  23.33 12.7 90 top
C11  10pF  [C0805]  29.9 12.7 270 top
C12  22uF  [C0805]  45.4 11.33 90 top
C13  22uF  [C0805]  40.8 12.54 270 top
C14  100nF  [C0805]  33.97 30.66 90 top
C15  100nF  [C0805]  31.74 30.66 90 top
CN2  XT30U-M  [CONN-TH_XT30U-M]  34 3.25 0 top
CN3  XT30U-M  [CONN-TH_XT30U-M]  34 37.75 0 top
CN4  L125WVS-02PW  [CONN-SMD_2P-P1.25_DELON_L125WVS-02PW]  13.66 3.5 0 top
CN5  GH125-S04DCA-00  [CONN-SMD_4P-P1.27_GH125-S04DCA-00]  45.03 37.6 180 top
CN6  L125WVS-02PW  [CONN-SMD_2P-P1.25_DELON_L125WVS-02PW]  3.49 29.7 270 top
CN7  L125WVS-02PW  [CONN-SMD_2P-P1.25_DELON_L125WVS-02PW]  3.49 11.42 270 top
CN8  L125WVS-02PW  [CONN-SMD_2P-P1.25_DELON_L125WVS-02PW]  54.86 3.5 0 top
CN9  L125WVS-02PW  [CONN-SMD_2P-P1.25_DELON_L125WVS-02PW]  22.52 3.5 0 top
D1  1N5819WS  [SOD-323_L1.8-W1.3-LS2.5-RD]  53.85 12 90 top
D2  1N5819WS  [SOD-323_L1.8-W1.3-LS2.5-RD]  53.84 20.6 90 top
FB1  120R  [L0805]  35.17 15.07 90 top
H9  PZ254R-11-03P  [HDR-TH_3P-P2.54-H-M-W10.4]  55.66 29 90 top
H13  PZ254R-11-03P  [HDR-TH_3P-P2.54-H-M-W10.4]  55.66 12 90 top
H14  PZ254R-11-03P  [HDR-TH_3P-P2.54-H-M-W10.4]  55.66 20.5 90 top
LED3  NCD0805R1  [LED0805-RD_RED]  51.7 11.94 270 top
LED4  NCD0805R1  [LED0805-RD_RED]  51.79 20.5 270 top
LED5  NCD0805R1  [LED0805-RD_RED]  40.7 17.71 270 top
LED10  NCD0805G1  [LED0805-R-RD]  13.05 10 180 top
LED11  NCD0805B2  [LED0805-R-RD]  13.04 12.5 180 top
Q2  PMBT3904,215  [SOT-23_L2.9-W1.3-P1.90-LS2.4-BR]  51.1 31.22 90 top
R1  10kΩ  [R0805]  16.61 14.69 0 top
R3  1.5kΩ  [R0805]  38.5 17.7 90 top
R4  1.5kΩ  [R0805]  7.44 22.7 0 top
R5  1.5kΩ  [R0805]  6.59 19.2 270 top
R6  10kΩ  [R0805]  53.08 34.8 180 top
R9  4.7kΩ  [R0805]  50 28.39 0 top
R10  1.5kΩ  [R0805]  51.71 16.1 270 top
R11  1.5kΩ  [R0805]  51.8 24.7 270 top
R12  1.5kΩ  [R0805]  17.39 12.5 180 top
R13  1.5kΩ  [R0805]  17.35 10 180 top
SW4  TS-1088-AR02016  [SW-SMD_L3.9-W3.0-P4.45]  53.08 37.63 0 top
SW6  TS-1088-AR02016  [SW-SMD_L3.9-W3.0-P4.45]  25.09 37.17 270 top
SW8  TS-1088-AR02016  [SW-SMD_L3.9-W3.0-P4.45]  20.22 37.16 270 top
TP1  -  [Test-Point-0.5mm]  17.71 29.5 0 top
TP6  -  [Test-Point-0.5mm]  8.1 20.23 0 top
TP7  -  [Test-Point-0.5mm]  6.43 24.25 0 top
TP8  -  [Test-Point-0.5mm]  21.9 11.74 0 top
TP9  -  [Test-Point-0.5mm]  31.34 13.83 0 top
U1  STM32F103C8T6  [LQFP-48_L7.0-W7.0-P0.50-LS9.0-BL]  26.84 22.25 0 top
U3  MAX3051  [SOIC-8_L4.9-W3.9-P1.27-LS6.2-BL]  15.29 21.04 90 top
U4  BMI088  [LGA-16_L4.5-W3.0-P0.50-BL]  14.6 29.5 270 top
U5  AZ1117D-3.3TRE1  [TO-252-2_L6.5-W6.1-P4.58-LS10.0-BR]  45.43 15.05 270 top
U7  HDGC1251WR-4P  [CONN-TH_4P-P1.25_HDGC_HDGC1251WR-4P]  13 36.37 180 top
U8  HDGC1251WR-4P  [CONN-TH_4P-P1.25_HDGC_HDGC1251WR-4P]  4.51 20.56 270 top
USB2  TYPE-C 6P(073)  [TYPE-C-SMD_TYPE-C-6P]  45.37 3.5 0 top
X1  16MHz  [OSC-SMD_4P-L3.2-W2.5-BL]  26.62 12.91 0 top

## Footprints (pads in the part's own frame, mm; a bottom-side part is the same pattern mirrored in y, then rotated)
C0805
  rect 1.41x1.35 smd: 1(-1,0) 2(1,0)
CONN-SMD_2P-P1.25_DELON_L125WVS-02PW
  rect 0.6x1.7 smd: 1(-0.625,1.6) 2(0.625,1.6)
  rect 1x2.7 smd: 3(2.475,-1.6) 4(-2.475,-1.6)
CONN-SMD_4P-P1.27_GH125-S04DCA-00
  rect 0.7x1.8 smd: 1(-1.875,1.75) 2(-0.625,1.75) 3(0.625,1.75) 4(1.875,1.75)
  rect 1x2.7 smd: 5(3.705,-1.75) 6(-3.705,-1.75)
CONN-TH_4P-P1.25_HDGC_HDGC1251WR-4P
  rect 1x1 hole 0.55: 1(-1.875,0)
  round 1 hole 0.55: 2(-0.625,0) 3(0.625,0) 4(1.875,0)
CONN-TH_XT30U-M
  round 3.8 hole 2.54: 1(-2.5,0) 2(2.5,0)
HDR-TH_3P-P2.54-H-M-W10.4
  rect 1.8x1.8 hole 1.1: 1(-2.54,0)
  round 1.8 hole 1.1: 2(0,0) 3(2.54,0)
L0805
  rect 1.133x1.377 smd: 1(-0.966,0) 2(0.966,0)
LED0805-R-RD
  rect 1x1.399 smd: 1(1.05,0) 2(-1.05,0)
LED0805-RD_RED
  rect 1x1.25 smd: 1(-1.1,0) 2(1.1,0)
LGA-16_L4.5-W3.0-P0.50-BL
  rect 0.8x0.25 smd: 1(-1.2,-1.498) 2(-1.2,-0.998) 3(-1.2,-0.498) 4(-1.2,0.002) 5(-1.2,0.502) 6(-1.2,1.002) 7(-1.2,1.502) 9(1.2,1.502) 10(1.2,1.002) 11(1.2,0.502) 12(1.2,0.002) 13(1.2,-0.498) 14(1.2,-0.998) 15(1.2,-1.498)
  rect 0.25x0.8 smd: 8(0,1.915) 16(0,-1.915)
LQFP-48_L7.0-W7.0-P0.50-LS9.0-BL
  oval 0.27x1.5 smd: 1(-2.75,-4.25) 2(-2.25,-4.25) 3(-1.75,-4.25) 4(-1.25,-4.25) 5(-0.75,-4.25) 6(-0.25,-4.25) 7(0.25,-4.25) 8(0.75,-4.25) 9(1.25,-4.25) 10(1.75,-4.25) 11(2.25,-4.25) 12(2.75,-4.25) 25(2.75,4.25) 26(2.25,4.25) 27(1.75,4.25) 28(1.25,4.25) 29(0.75,4.25) 30(0.25,4.25) 31(-0.25,4.25) 32(-0.75,4.25) 33(-1.25,4.25) 34(-1.75,4.25) 35(-2.25,4.25) 36(-2.75,4.25)
  oval 1.5x0.27 smd: 13(4.25,-2.75) 14(4.25,-2.25) 15(4.25,-1.75) 16(4.25,-1.25) 17(4.25,-0.75) 18(4.25,-0.25) 19(4.25,0.25) 20(4.25,0.75) 21(4.25,1.25) 22(4.25,1.75) 23(4.25,2.25) 24(4.25,2.75) 37(-4.25,2.75) 38(-4.25,2.25) 39(-4.25,1.75) 40(-4.25,1.25) 41(-4.25,0.75) 42(-4.25,0.25) 43(-4.25,-0.25) 44(-4.25,-0.75) 45(-4.25,-1.25) 46(-4.25,-1.75) 47(-4.25,-2.25) 48(-4.25,-2.75)
OSC-SMD_4P-L3.2-W2.5-BL
  rect 1.4x1.2 smd: 1(-1.1,-0.875) 2(1.1,-0.875) 3(1.1,0.875) 4(-1.1,0.875)
R0805
  rect 1.133x1.377 smd: 1(-1,0) 2(1,0)
SOD-323_L1.8-W1.3-LS2.5-RD
  rect 1x0.75 smd: 1(-1.173,0) 2(1.173,0)
SOIC-8_L4.9-W3.9-P1.27-LS6.2-BL
  oval 0.588x2.045 smd: 1(-1.905,-2.772) 2(-0.635,-2.772) 3(0.635,-2.772) 4(1.905,-2.772) 5(1.905,2.772) 6(0.635,2.772) 7(-0.635,2.772) 8(-1.905,2.772)
SOT-23_L2.9-W1.3-P1.90-LS2.4-BR
  rect 1x0.8 smd: 1(1.15,-0.95) 2(1.15,0.95) 3(-1.15,0)
SW-SMD_L3.9-W3.0-P4.45
  rect 1.23x1.36 smd: 1(-2.185,0) 2(2.185,0)
Test-Point-0.5mm
  round 0.5 smd: 1(0,0)
TO-252-2_L6.5-W6.1-P4.58-LS10.0-BR
  rect 2.336x1.064 smd: 1(3.486,-2.29) 3(3.486,2.29)
  rect 5.826x5.491 smd: 4(-3.486,0)
TYPE-C-SMD_TYPE-C-6P
  oval 1.1x1.9 hole 0.7x1.5: 7(-4.32,1.837) 7(-4.32,-1.962) 7(4.32,1.837) 7(4.32,-1.962)
  rect 0.7x1 smd: A5(-0.5,1.962) A9(1.5,1.962) B5(0.5,1.962) B9(-1.5,1.962)
  rect 0.8x1 smd: A12(2.7,1.962) B12(-2.7,1.962)

## Nets
As in the schematic.

Pads without a net: CN4 3 4; CN5 5 6; CN6 3 4; CN7 3 4; CN8 3 4; CN9 3 4; U1 2 3 4 12 14 20 21 22 27 32 33 39 40; U4 1 13; USB2 7 A5 A9 B5 B12

## Via types
v1: diameter 4.5, hole 3.1, Top Layer to Bottom Layer, 4 vias
v2: diameter 0.61, hole 0.305, Top Layer to Bottom Layer, 93 vias

## Routing (per net, layer and track width the routed paths; a pad name or vN(x,y) marks a point on that pad's centre or on a via; arc(x,y) is an arc through that point)
+3.3V: length 169.2
  Top Layer w0.305: v2(6.48,16.62) 6.59,16.73 R5.2 ; R6.2 51.29,34.02 46.81,34.02 45.25,32.45 v2(45.25,26.93) ; U7.4 11.12,34.93 v2(11.07,34.88) 11.07,34.45 14.1,31.42 U4.3 ; C1.1 24.88,16.31 24.09,17.09 U1.1 24.1,18.01 24.1,19.13 ; v2(24.1,23.86) 26.24,21.72 26.24,19.72 25.65,19.13 24.1,19.13 ; v2(11.99,8.18) 12,8.2 LED10.1 11.99,10.01 LED11.1 ; U8.4 6.11,18.69 R5.2 ; 24.1,19.13 23.74,19.5 21.96,19.5 21.77,19.3 21.77,17.7 21.27,17.2 C4.1 20.52,17.17 16.76,17.17 15.37,18.57 15.37,21.01 16.03,21.67 17.7,21.67 ; v2(9.02,24.29) 8.44,23.71 R4.2 8.43,22.7 8.43,21.19 9.37,20.25 9.37,19.41 8.16,18.2 R5.2 ; v2(23.39,26.47) 24.06,26.47 24.09,26.5 24.09,27.11 23.3,27.9 C3.1 ; v2(31.12,25.53) 31.12,25.02 U1.24 ; U3.3 17.7,21.67 ; 17.7,21.67 v2(16.31,23.07) ; U4.11 15.09,28.28 15.09,26.47 15.44,26.12 v2(15.44,25.56)
  Top Layer w0.508: C2.1 35.17,25.88 v2(36.22,26.93) ; C2.1 35.61,23.54 35.61,19.16 C8.1 35.17,17.68 FB1.2 ; C2.1 32.93,25.53 v2(31.12,25.53) ; C3.1 C5.1 ; D2.1 53.81,19.4 LED4.2 49,22.19 v2(49,24.85) ; C15.1 C14.1 34.01,29.62 v2(35.74,29.62) ; v2(47.4,27.13) 47.4,28.07 47.71,28.39 R9.1
  Bottom Layer w0.305: v2(16.31,23.07) 16.31,24.69 v2(15.44,25.56) 15.44,25.58 15.19,25.84 10.59,25.84 9.04,24.29 v2(9.02,24.29) 9.02,32.82 v2(11.07,34.88) ; v2(6.48,16.62) v2(6.48,15.27) 6.48,13.69 v2(11.99,8.18) ; v2(23.39,26.47) 23.39,24.57 v2(24.1,23.86) 24.71,23.25 29.97,23.25 31.06,24.34 31.12,24.34 v2(31.12,25.53)
  Bottom Layer w0.508: v2(35.74,29.62) 36.22,29.14 v2(36.22,26.93) v2(45.25,26.93) 47.19,26.93 v2(47.4,27.13) 49,25.53 v2(49,24.85)
+3.3V_: length 2.3
  Top Layer w0.508: H14.2 54.39,21.77 D2.2
+3.3VA: length 9.4
  Top Layer w0.305: U1.9 28.09,17.09 28.26,16.92 29.77,16.92 30.48,16.21 C6.1 31.25,15.88 C7.1 35.14,14.07 FB1.1
+3.3VE: length 44.5
  Bottom Layer w0.508: H14.1 57.84,20.14 57.84,33.38 56.13,35.08 34.17,35.08 CN3.1
+3.3VI: length 15
  Top Layer w0.508: LED5.2 40.8,16.51 C13.1
  Bottom Layer w0.508: v2(44.27,21.9) v2(45.36,21.9) v2(46.41,21.9) 54.52,21.9 H14.3
GND: length 15.3
  Top Layer w0.305: U4.2 13.6,31.23 12.95,31.88 v2(12.14,31.88) ; U4.7 U4.6 ; C3.2 25.3,28.25 24.59,27.54 24.59,26.5 24.59,26.5 ; v2(29.44,24.19) 29.87,24.19 30.19,24.5 31.09,24.5 ; C6.2 28.48,16.46 28.07,16.46 27.63,16.91 27.63,17.05 27.59,17.09 U1.8 ; v2(18.95,18.11) 19.46,18.11 C4.2 20.89,19.2 21.69,20 U1.47 ; U4.4 14.6,31.83 v2(14.45,31.98)
  vias: v2(1.45,34.17) v2(1.63,6.86) v2(1.96,25.27) v2(1.96,15.75) v2(7.42,26.62) v2(7.37,1.91) v2(7.65,7.27) v2(7.98,38.21) v2(12.88,16.84) v2(13.66,2.42) v2(15.88,31.78) v2(17.45,25.43) v2(17.96,2.37) v2(18.16,5.8) v2(22.52,2.42) v2(26.62,6.76) v2(26.77,29.61) v2(27.33,2.19) v2(28.12,19.41) v2(30.94,18.32) v2(34.55,34.17) v2(35.71,31.76) v2(37.19,24.54) v2(38.25,34.12) v2(38.65,10.58) v2(39.4,5.69) v2(49.68,13.34) v2(58.24,5.75) v2(58.75,39.5) v2(62.46,24.82) v2(62.46,16.27) v2(62.46,7.88) v2(63.63,33.2)
VBUS: length 49.8
  Top Layer w0.508: v2(43.71,33.71) 43.16,34.27 CN5.4 ; LED3.2 51.71,10.83 D1.1 53.85,8.4 54.91,7.34 58.12,7.34 58.57,7.8 58.57,28.17 57.78,28.96 55.7,28.96 H9.2
  Bottom Layer w0.508: v2(43.71,33.71) 50.95,33.71 H9.2
VBUS_: length 2.3
  Top Layer w0.508: D1.2 54.49,13.17 H13.2
VBUS_E: length 28.7
  Top Layer w0.508: CN2.1 31.5,3.25 31.5,6.61 32.18,7.29 50.55,7.29 v2(50.57,7.32)
  Bottom Layer w0.508: H13.1 52.71,9.46 v2(50.57,7.32)
VBUS_I: length 17.1
  Top Layer w0.508: v2(43.89,6.56) 43.89,5.48 USB2.B9
  Bottom Layer w0.508: v2(43.89,6.56) 43.89,8.13 45.67,9.91 v2(46.91,9.91) v2(47.77,9.91) 51.03,9.91 H13.3
(no net):
  vias: v1(4,37) v1(4,4) v1(62,37) v1(62,4)
BOOT0: length 14
  Top Layer w0.305: 22.59,21.5 24.2,21.5 v2(25.48,20.22) ; R1.2 17.64,14.66 v2(19.15,14.66)
  Bottom Layer w0.305: v2(25.48,20.22) 25.48,19.59 20.55,14.66 v2(19.15,14.66)
BUTTON1: length 12
  Top Layer w0.305: SW6.2 25.52,34.55 v2(26.97,34.55) ; 29.59,26.5 30.25,27.16 v2(30.25,31.63)
  Bottom Layer w0.305: v2(26.97,34.55) 27.13,34.55 30.05,31.63 v2(30.25,31.63)
BUTTON2: length 15.7
  Top Layer w0.305: 29.09,26.5 29.09,27.4 29.54,27.85 v2(29.54,31.09) ; SW8.2 20.68,34.52 v2(22,34.52)
  Bottom Layer w0.305: v2(29.54,31.09) 29.11,31.09 26.06,34.14 22.38,34.14 v2(22,34.52)
CAN_H: length 85.7
  Top Layer w0.305: CN8.2 55.49,5.81 54.89,6.41 54.38,6.41 51.94,8.84 26.88,8.84 CN9.2 23.14,5.67 21.82,6.99 15.54,6.99 14.29,5.73 ; 11.35,20.41 9.88,21.87 9.88,28 8.8,29.08 CN6.2 ; 11.35,20.41 10.74,19.8 10.74,14.94 6.6,10.79 5.43,10.79 ; 11.35,20.41 U3.7 ; CN4.2 14.29,5.73 ; 14.29,5.73 14.29,5.76 13.13,6.91 9.31,6.91 5.43,10.79 ; CN7.2 5.43,10.79
CAN_L: length 90.9
  Top Layer w0.305: CN8.1 54.24,5.13 51.26,8.11 29.64,8.11 25.48,3.94 22.05,3.94 21.89,4.1 21.89,4.95 ; U3.6 11.35,21.67 v2(10.82,22.2) 10.82,29.7 10.19,30.33 CN6.1 ; 21.89,4.95 CN9.1 ; 21.89,4.95 20.88,3.94 13.73,3.94 13.04,4.64 13.04,4.79 ; 13.04,4.79 12.19,3.94 9.53,3.94 3.63,9.83 3.63,11.66 4.01,12.04 CN7.1 6.71,12.04 9.91,15.24 9.91,20.81 v2(9.93,20.83) ; 13.04,4.79 CN4.1
  Bottom Layer w0.305: v2(9.93,20.83) 10.82,21.72 v2(10.82,22.2)
CAN_RX: length 5.3
  Top Layer w0.305: U1.45 21.07,21 19.12,22.94 18.07,22.94
CAN_TX: length 5.6
  Top Layer w0.305: 22.59,20.5 22.58,20.5 19.63,20.5 19.38,20.25 19.38,19.31 19.21,19.14 U3.1
DBUS: length 4
  Top Layer w0.305: Q2.1 54.83,32.37 H9.3
HSE_IN: length 10.3
  Top Layer w0.305: U1.5 26.09,16.18 26.54,15.72 26.54,13.06 X1.1 25.18,11.7 C10.1 23.29,11.74 TP8.1
HSE_OUT: length 8.4
  Top Layer w0.305: U1.6 26.59,17.09 27.28,16.4 27.28,14.23 X1.3 27.81,13.7 C11.1 31.21,13.7 TP9.1
I2C1_SCL: length 19.6
  Top Layer w0.305: 22.59,22.5 22.58,22.48 v2(20.85,22.48) ; v2(8.58,19.72) 8.58,19.75 TP6.1 8.07,20.2 R5.1 6.33,19.93 4.51,19.93
  Bottom Layer w0.305: v2(20.85,22.48) 18.09,19.72 v2(8.58,19.72)
I2C1_SDA: length 36.7
  Top Layer w0.305: U8.2 4.92,21.19 R4.1 6.43,22.71 TP7.1 3.9,24.25 2.57,22.92 2.57,18.34 5,15.91 8.86,15.91 v2(8.89,15.93) ; v2(21.34,21.82) 21.51,21.82 21.69,22 U1.43
  Bottom Layer w0.305: v2(21.34,21.82) 15.44,15.93 v2(8.89,15.93)
INT1_ACC: length 15.9
  Top Layer w0.305: U1.41 21.58,23 20.65,23.93 13.08,23.93 12.29,24.72 12.29,29.11 U4.16
INT1_GYR: length 11.4
  Top Layer w0.305: 22.59,24.5 15.36,24.5 14.53,25.33 14.53,28.23 U4.12
LED1: length 35.4
  Top Layer w0.305: R12.1 19.34,12.5 21.72,10.11 35.59,10.11 36.58,11.1 36.58,21.11 v2(36.35,21.34) ; U1.18 31.93,22 32.54,21.39 v2(33.1,21.39)
  Bottom Layer w0.305: v2(33.1,21.39) 33.15,21.34 v2(36.35,21.34)
LED2: length 36.9
  Top Layer w0.305: v2(36.47,22.25) 37.21,21.52 37.21,10.7 36.02,9.5 18.85,9.5 R13.1 ; v2(33.27,22.48) 32.01,22.48 31.99,22.5 31.09,22.5
  Bottom Layer w0.305: v2(33.27,22.48) 33.5,22.25 v2(36.47,22.25)
NRST: length 43.6
  Top Layer w0.305: v2(27.1,20.02) 27.1,18.01 U1.7 ; C9.1 56.93,37.63 SW4.2 55.26,35.98 R6.1 52.63,33.35 47.47,33.35 46.05,31.93 46.05,26.27 43.36,23.58 39.57,23.58 v2(37.79,21.8)
  Bottom Layer w0.305: v2(27.1,20.02) 36.02,20.02 v2(37.79,21.8)
PWR_LED_K: length 2.2
  Top Layer w0.508: LED5.1 40.59,18.7 R3.2
SPI1_CS_ACC: length 21.4
  Top Layer w0.305: 28.09,26.5 28.09,31.02 27.05,32.06 19.18,32.06 17.11,29.99 14.62,29.99 13.61,28.99 13.61,28.31 U4.14
SPI1_CS_GYR: length 22.2
  Top Layer w0.305: v2(27.2,30.71) 27.59,30.33 27.59,26.5 ; v2(14,33.66) 15.1,32.55 U4.5
  Bottom Layer w0.305: v2(14,33.66) 24.26,33.66 v2(27.2,30.71)
SPI1_MISO: length 23.2
  Top Layer w0.305: 13.11,27.46 13.1,27.47 U4.15 ; v2(28.8,21.31) 29.12,21 U1.16 ; U4.10 15.6,27.53 v2(15.72,27.41)
  Bottom Layer w0.305: v2(28.8,21.31) 23.47,21.31 18.19,26.6 15.73,26.6 ; 15.73,26.6 14.87,27.46 13.11,27.46 ; 15.73,26.6 15.73,27.41 v2(15.72,27.41)
  vias: v2(13.11,27.41)
SPI1_MOSI: length 18.1
  Top Layer w0.305: v2(29.31,22.36) 30.17,21.5 31.09,21.5 ; v2(16.51,27.41) 16.48,27.44 16.48,27.92 U4.9
  Bottom Layer w0.305: v2(29.31,22.36) 24.03,22.36 18.97,27.41 v2(16.51,27.41)
SPI1_SCK: length 18.3
  Top Layer w0.305: U4.8 16.52,29.49 19.48,29.49 28.48,20.5 31.09,20.5
SWCLK: length 15.1
  Top Layer w0.305: U1.37 18.9,28.69 v2(18.9,28.73) ; U7.2 13.62,35.72 17.27,32.07 v2(17.27,31.5)
  Bottom Layer w0.305: v2(18.9,28.73) 18.9,29.85 17.32,31.42 17.32,31.45 v2(17.27,31.5)
SWDIO: length 17.7
  Top Layer w0.305: v2(25.78,25.25) 25.51,25.25 25.09,25.68 25.09,26.5 ; v2(17.45,32.97) 14.88,35.55 U7.1
  Bottom Layer w0.305: v2(17.45,32.97) 18.06,32.97 v2(25.78,25.25)
USART1_RX: length 26.4
  Top Layer w0.305: 26.59,26.5 26.59,25.43 26.87,25.15 29.64,25.15 31.7,27.21 34.95,27.21 39.47,31.73 43.59,31.73 46.91,35.05 CN5.1
USART1_TX: length 26.1
  Top Layer w0.305: CN5.2 45.66,34.76 43.56,32.67 29.9,32.67 28.7,31.47 v2(28.7,28.91) ; 27.09,26.5 27.09,27.7 v2(26.7,28.1)
  Bottom Layer w0.305: v2(28.7,28.91) 27.89,28.1 v2(26.7,28.1)
USART2_RX: length 25.4
  Top Layer w0.305: v2(33.3,19.41) 31.18,19.41 31.09,19.5 ; v2(38.28,20.15) 41.02,22.89 45.5,22.89 R9.2 51.1,28.49 Q2.3
  Bottom Layer w0.305: v2(33.3,19.41) 37.54,19.41 v2(38.28,20.15)
$1N15895: length 2.3
  Top Layer w0.305: 14.09,12.5 R12.2
$1N15981: length 2.3
  Top Layer w0.305: R13.2 LED10.2
$7N3476: length 2.1
  Top Layer w0.508: R10.2 51.7,15.09 LED3.1
$7N3478: length 2.1
  Top Layer w0.508: R11.2 51.79,23.69 LED4.1

## Copper pours and planes (outline as drawn; the poured copper is in the pictures)
+3.3VI on Top Layer: 39.8,22.41 48.73,22.41 48.73,12.73 39.8,12.73
GND on Top Layer: -0.53,41.33 66.22,41.33 66.22,-0.4 -0.53,-0.4
GND on Bottom Layer: -0.28,41.33 66.22,41.33 66.22,-0.4 -0.28,-0.4
VBUS_I on Top Layer: 44.44,12.92 48.48,12.92 48.48,9.4 44.44,9.4

Small or netless copper shapes (teardrops, artwork), in the pictures only: 188 on Top Layer, 57 on Bottom Layer

## Text on the board
Top Silkscreen Layer: DBUS | 3VI | 3VE | + | S | - | 5VI | 5VE | PB0 | PB1 | PWR | 3V3 | GND | UART1 | RST | CAN | SWD | C | D | PB13 | PB12 | 5V | TX | RX
